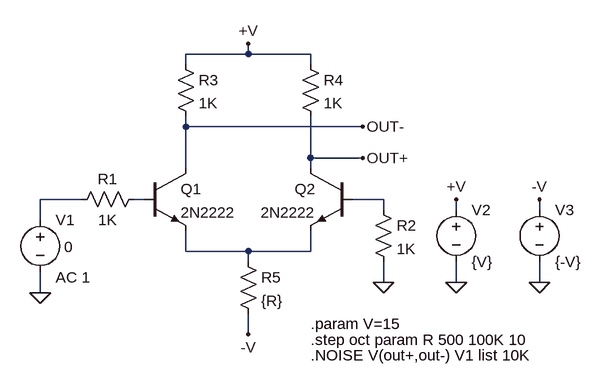
[diagram p0: schematic stepnoise.asc]
stepnoise.asc, the LTspice schematic file:
Version 4
SHEET 1 2728 1624
WIRE 1808 1136 1808 1104
WIRE 1808 1248 1808 1216
WIRE 1872 1104 1808 1104
WIRE 1968 1104 1952 1104
WIRE 2032 896 2032 880
WIRE 2032 992 2032 976
WIRE 2032 1056 2032 992
WIRE 2032 1184 2032 1152
WIRE 2128 880 2032 880
WIRE 2128 880 2128 864
WIRE 2128 1184 2032 1184
WIRE 2128 1200 2128 1184
WIRE 2128 1312 2128 1280
WIRE 2224 880 2128 880
WIRE 2224 896 2224 880
WIRE 2224 1040 2224 976
WIRE 2224 1056 2224 1040
WIRE 2224 1184 2128 1184
WIRE 2224 1184 2224 1152
WIRE 2304 992 2032 992
WIRE 2304 1040 2224 1040
WIRE 2336 1104 2288 1104
WIRE 2336 1120 2336 1104
WIRE 2336 1232 2336 1200
WIRE 2448 1120 2448 1104
WIRE 2448 1232 2448 1200
WIRE 2576 1120 2576 1104
WIRE 2576 1232 2576 1200
FLAG 2448 1232 0
FLAG 2576 1232 0
FLAG 1808 1248 0
FLAG 2576 1104 -V
FLAG 2448 1104 +V
FLAG 2128 1312 -V
FLAG 2128 864 +V
FLAG 2304 992 OUT-
FLAG 2304 1040 OUT+
FLAG 2336 1232 0
SYMBOL voltage 2448 1104 R0
SYMATTR InstName V2
SYMATTR Value {V}
SYMBOL voltage 2576 1104 R0
SYMATTR InstName V3
SYMATTR Value {-V}
SYMBOL res 1968 1088 R90
WINDOW 0 0 56 VBottom 0
WINDOW 3 32 56 VTop 0
SYMATTR InstName R1
SYMATTR Value 1K
SYMBOL voltage 1808 1120 R0
WINDOW 3 37 57 Left 0
WINDOW 39 0 0 Left 0
WINDOW 123 24 104 Left 0
SYMATTR Value 0
SYMATTR Value2 AC 1
SYMATTR InstName V1
SYMBOL npn 1968 1056 R0
SYMATTR InstName Q1
SYMATTR Value 2N2222
SYMBOL npn 2288 1056 M0
SYMATTR InstName Q2
SYMATTR Value 2N2222
SYMBOL res 2016 880 R0
SYMATTR InstName R3
SYMATTR Value 1K
SYMBOL res 2208 880 R0
SYMATTR InstName R4
SYMATTR Value 1K
SYMBOL res 2112 1184 R0
SYMATTR InstName R5
SYMATTR Value {R}
SYMBOL res 2320 1104 R0
SYMATTR InstName R2
SYMATTR Value 1K
TEXT 2224 1344 Left 0 !.NOISE V(out+,out-) V1 list 10K
TEXT 2224 1296 Left 0 !.param V=15
TEXT 2224 1320 Left 0 !.step oct param R 500 100K 10

The netlist it stands for:
* stepnoise.asc
V2 +V 0 {V}
V3 -V 0 {-V}
R1 N002 N001 1K
V1 N001 0 0 AC 1
Q1 OUT- N002 N003 0 2N2222
Q2 OUT+ N004 N003 0 2N2222
R3 +V OUT- 1K
R4 +V OUT+ 1K
R5 N003 -V {R}
R2 N004 0 1K
.model NPN NPN
.model PNP PNP
.lib standard.bjt
.NOISE V(out+,out-) V1 list 10K
.param V=15
.step oct param R 500 100K 10
.backanno
.end